# Altium schematic sheet TSAL_Control_Scrutineering.SchDoc
size A4; SheetNumber: 1; SheetTotal: 2
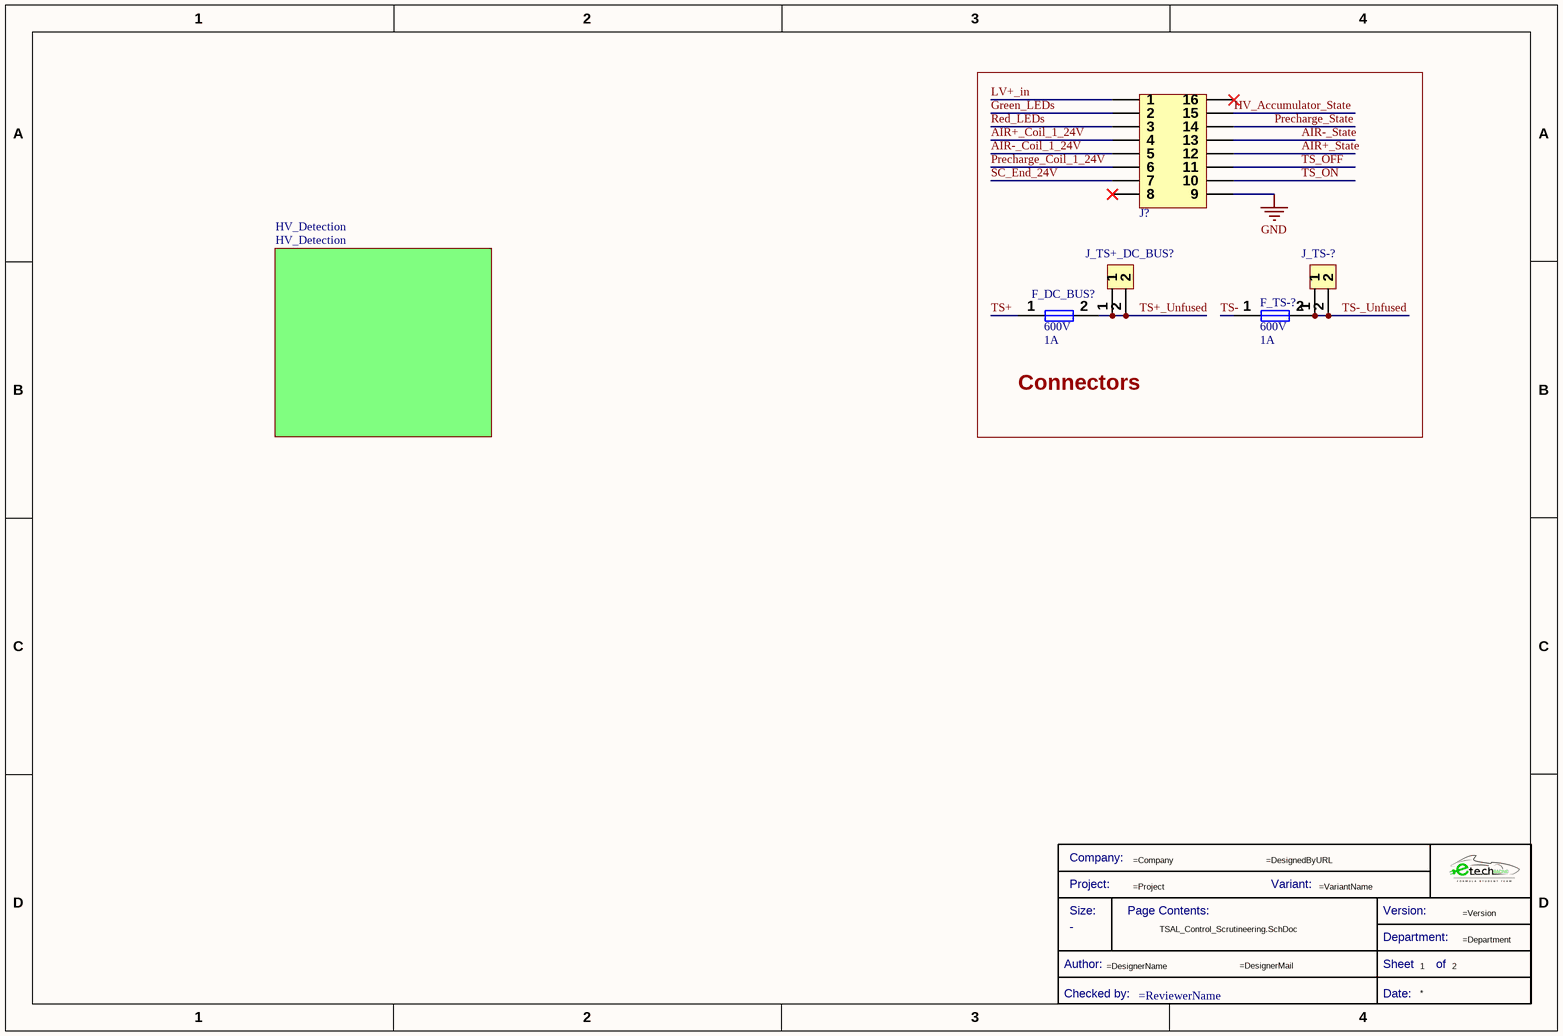
[diagram p0: TSAL_Control_Scrutineering.SchDoc]

## Parts
*  Title Block_template  (value not drawn)  (graphical)
F_DC_BUS?  Voltage Rating (DC): 600V  Current Rating: 1A  [Fuse_485001]  (hidden comment: 485001)
F_TS-?  Voltage Rating (DC): 600V  Current Rating: 1A  [Fuse_485001]  (hidden comment: 485001)
J?  1053101116  [J_NanoFit_2x8_V]  (value not drawn)
J_TS+_DC_BUS?  436500215  [J_MicroFit_2x1]  (value not drawn)
J_TS-?  436500215  [J_MicroFit_2x1]  (value not drawn)

## Blocks framed on the sheet
Connectors: F_DC_BUS? F_TS-? J? J_TS+_DC_BUS? J_TS-?

## Sub-sheets
HV_Detection = HV_Detection: no entries

## Nets
GND: J?.9
AIR+_Coil_1_24V: J?.4
AIR+_State: J?.12
AIR-_Coil_1_24V: J?.5
AIR-_State: J?.13
Green_LEDs: J?.2
HV_Accumulator_State: J?.15
LV+_in: J?.1
Precharge_Coil_1_24V: J?.6
Precharge_State: J?.14
Red_LEDs: J?.3
SC_End_24V: J?.7
TS+: F_DC_BUS?.1
TS+_Unfused: F_DC_BUS?.2 J_TS+_DC_BUS?.1 J_TS+_DC_BUS?.2
TS-: F_TS-?.1
TS-_Unfused: F_TS-?.2 J_TS-?.1 J_TS-?.2
TS_OFF: J?.11
TS_ON: J?.10

Not connected (* = marked no-connect by the designer): J? 8* 16*

## Notes on the sheet
- (in symbol Title Block_template) Company:; Project:; Variant:; Size:; Page Contents:; Version:; Department:; Author:; Sheet; of; Checked by:; Date:

## Library data of the parts
* = Title Block_template: Standard Title Block; .Creator: GP; Category: Title Block; .PCBcheck: GP; .SCHcheck: GP; Checked by:: =ReviewerName; Size: -
F_DC_BUS? F_TS-? = Fuse_1A_600V: Surface Mount Fuses 600V 1A Fast Acting; Manufacturer 1: Littelfuse; Manufacturer Part Number 1: 0485001.DR; Body Material: Ceramic; Voltage Rating (AC): 250V; Resistance: 264mR; DC Cold Resistance: 304.4mR; Fuse Type: Board Mount (Cartridge Style Excluded); Approvals: UL,CSA; .Creator: DO; Supplier 1: Arrow Electronics; RoHS: Yes; Category: Fuses; Stock 1: 4123; Pricing 1: 1=2,82900, 5=2,81400, 10=2,75200, 50=2,59800, 100=2,40300, 250=2,37900, 500=2,30400, 1500=2,24900, 3000=2,11600 (USD); Mount: Surface Mount; Case/Package: SMD/SMT; Housing Material: Ceramic; Min Operating Temperature: -55°C; Max Operating Temperature: 125°C; Packaging: Tape and Reel; Package Quantity: 1; Series: 485; Termination: SMD/SMT; Fuse Current: 1A; Length: 12.1mm; Width: 0.177inch; Height: 0.177inch; Depth: 4.5mm; REACH SVHC: No SVHC; Lead Free: Lead Free; RoHS Compliant: Yes; ComponentLink1URL: http://www.farnell.com/datasheets/1945989.pdf?src-supplier=Farnell; ComponentLink1Description: http://www.farnell.com/datasheets/1945989.pdf?src-supplier=Farnell; ComponentLink2URL: http://www.farnell.com/datasheets/2282568.pdf?src-supplier=Farnell; ComponentLink2Description: http://www.farnell.com/datasheets/2282568.pdf?src-supplier=Farnell; ComponentLink3URL: http://www.mouser.com/ds/2/240/Littelfuse485_datasheet_080512-201879.pdf?src-supplier=Mouser; ComponentLink3Description: http://www.mouser.com/ds/2/240/Littelfuse485_datasheet_080512-201879.pdf?src-supplier=Mouser; ComponentLink4URL: http://components.arrow.com/part/dataview/56707787S790276N3675?src-supplier=Arrow+Electronics; ComponentLink4Description: http://components.arrow.com/part/dataview/56707787S790276N3675?src-supplier=Arrow+Electronics; ComponentLink5URL: http://www.littelfuse.com/~/media/Files/Littelfuse/Technical%20Resources/Documents/Data%20Sheets/Littelfuse_Fuse_485_Datasheet.pdf?src-supplier=Element14; ComponentLink5Description: http://www.littelfuse.com/~/media/Files/Littelfuse/Technical%20Resources/Documents/Data%20Sheets/Littelfuse_Fuse_485_Datasheet.pdf?src-supplier=Element14; ComponentLink6URL: http://www.littelfuse.com/~/media/electronics/datasheets/fuses/littelfuse_fuse_485_datasheet.pdf.pdf?src-supplier=Digi-Key; ComponentLink6Description: http://www.littelfuse.com/~/media/electronics/datasheets/fuses/littelfuse_fuse_485_datasheet.pdf.pdf?src-supplier=Digi-Key; Supplier Part Number 1: 0485001.DR; Voltage Rating: 600V
J? = J_NanoFit_2x8_V: Nano-Fit Vertical Header Through Hole 2.50mm Pitch Dual Row 16 Circuits with Kinked Pins Tin (Sn) Plating Black; Manufacturer 1: Molex; Manufacturer Part Number 1: 105310-1116; Connector Type: Header,Male Pin; Number of Positions: 16; .Creator: AC; Supplier 1: Digi-Key; RoHS: No; Category: Headers and Wire Housings; Stock 1: 84; Pricing 1: 1=3,21000, 10=2,82400, 84=2,24619, 1008=1,86110, 4956=1,66858 (USD); Mount: Through Hole; Contact Plating: Tin; Contact Material: Brass; Contact Shape: Square; Insulation Material: Polymer; Insulation Color: Black; Min Operating Temperature: -40°C; Max Operating Temperature: 105°C; Fastening Type: Latch; Packaging: Tray; Number of Rows: 2; Termination: Kinked Pin; ComponentLink1URL: https://www.molex.com/pdm_docs/sd/1053101210_sd.pdf?src-supplier=Digi-Key; ComponentLink1Description: https://www.molex.com/pdm_docs/sd/1053101210_sd.pdf?src-supplier=Digi-Key; Supplier Part Number 1: WM16885-ND; ComponentLink2Description: Molex; ComponentLink2URL: https://www.molex.com/molex/products/part-detail/pcb_headers/1053101116
J_TS+_DC_BUS? J_TS-? = J_MicroFit_2x1: Header 1 Row Vertical Polarizing Peg 2 Pin SMT/Glow Wire Compatible Tin Plate; Manufacturer 1: Molex; Manufacturer Part Number 1: 43650-0215; Supplier 1: Arrow Electronics; RoHS: Yes; Category: Headers and Wire Housings; Stock 1: 11086; Pricing 1: 1=0,87800, 10=0,74400, 80=0,63070, 3264=0,47000, 6528=0,45100, 13056=0,41760 (USD); ComponentLink1URL: https://datasheet.ciiva.com/19462/884109-19462034.pdf?src-supplier=Jameco; ComponentLink1Description: https://datasheet.ciiva.com/19462/884109-19462034.pdf?src-supplier=Jameco; ComponentLink2URL: https://datasheet.ciiva.com/5157/0436500215-pcb-headers-148687-5157608.pdf?src-supplier=Mouser; ComponentLink2Description: https://datasheet.ciiva.com/5157/0436500215-pcb-headers-148687-5157608.pdf?src-supplier=Mouser; ComponentLink3URL: https://datasheet.ciiva.com/16085/0436500215-pcb-headers-16085668.pdf?src-supplier=Onlinecomponents.com; ComponentLink3Description: https://datasheet.ciiva.com/16085/0436500215-pcb-headers-16085668.pdf?src-supplier=Onlinecomponents.com; ComponentLink4URL: https://datasheet.ciiva.com/11748/0900766b80307ce2-11748388.pdf?src-supplier=RSComponents; ComponentLink4Description: https://datasheet.ciiva.com/11748/0900766b80307ce2-11748388.pdf?src-supplier=RSComponents; ComponentLink5URL: https://datasheet.ciiva.com/9432/0436500215-pcb-headers-9432850.pdf?src-supplier=Avnet; ComponentLink5Description: https://datasheet.ciiva.com/9432/0436500215-pcb-headers-9432850.pdf?src-supplier=Avnet; ComponentLink6URL: https://datasheet.ciiva.com/7920/1889390-7920892.pdf?src-supplier=Element14; ComponentLink6Description: https://datasheet.ciiva.com/7920/1889390-7920892.pdf?src-supplier=Element14; Supplier Part Number 1: 43650-0215